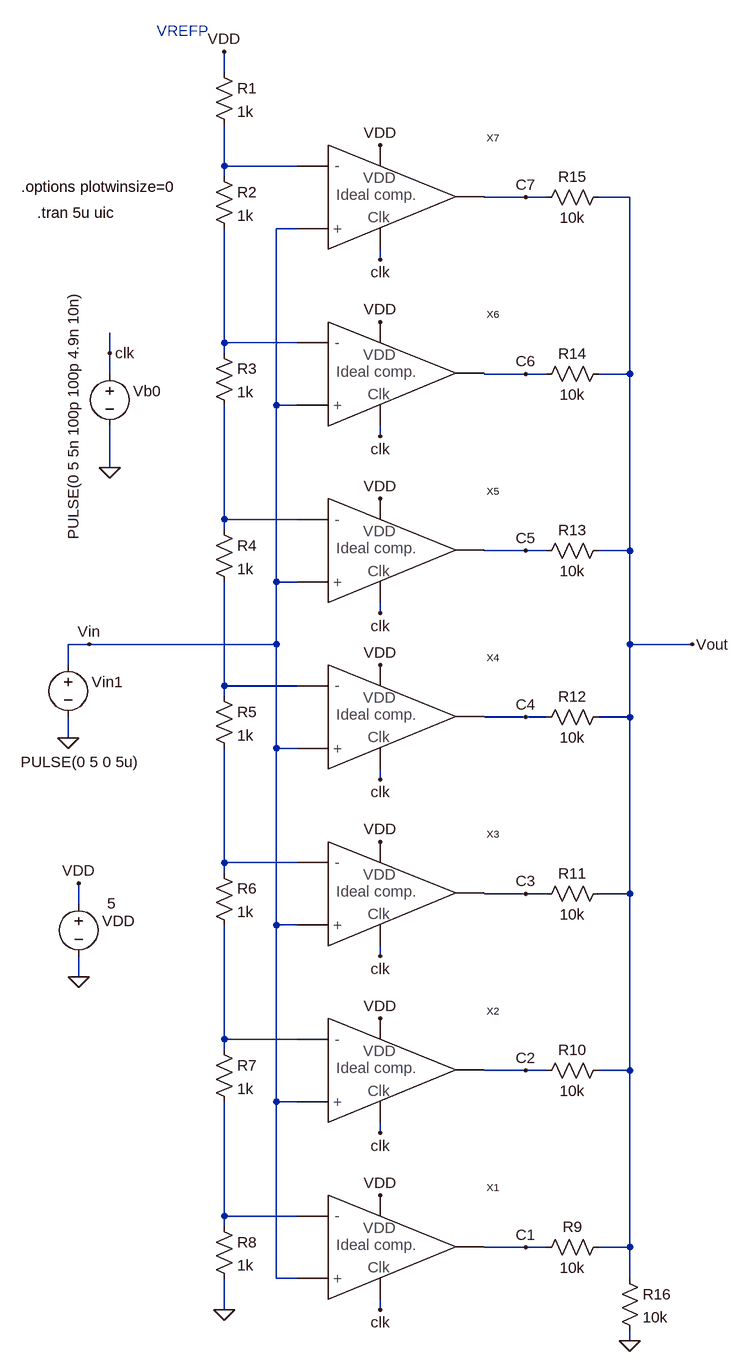
[diagram p0: schematic Fig29_23.asc]
Fig29_23.asc, the LTspice schematic file:
Version 4
SHEET 1 1608 932
WIRE 816 -1088 816 -1120
WIRE 816 -944 816 -1008
WIRE 928 -944 816 -944
WIRE 816 -928 816 -944
WIRE 1280 -896 1216 -896
WIRE 1312 -896 1280 -896
WIRE 1440 -896 1392 -896
WIRE 928 -848 896 -848
WIRE 1056 -800 1056 -816
WIRE 816 -672 816 -848
WIRE 928 -672 816 -672
WIRE 640 -656 640 -688
WIRE 816 -656 816 -672
WIRE 640 -624 640 -656
WIRE 1280 -624 1216 -624
WIRE 1312 -624 1280 -624
WIRE 1440 -624 1440 -896
WIRE 1440 -624 1392 -624
WIRE 896 -576 896 -848
WIRE 928 -576 896 -576
WIRE 1056 -528 1056 -544
WIRE 640 -480 640 -544
WIRE 816 -400 816 -576
WIRE 928 -400 816 -400
WIRE 816 -384 816 -400
WIRE 1280 -352 1216 -352
WIRE 1312 -352 1280 -352
WIRE 1440 -352 1440 -624
WIRE 1440 -352 1392 -352
WIRE 896 -304 896 -576
WIRE 928 -304 896 -304
WIRE 1056 -256 1056 -272
WIRE 608 -208 576 -208
WIRE 896 -208 896 -304
WIRE 896 -208 608 -208
WIRE 1440 -208 1440 -352
WIRE 1536 -208 1440 -208
WIRE 576 -176 576 -208
WIRE 816 -144 816 -304
WIRE 928 -144 816 -144
WIRE 816 -128 816 -144
WIRE 1280 -96 1216 -96
WIRE 1312 -96 1280 -96
WIRE 1440 -96 1440 -208
WIRE 1440 -96 1392 -96
WIRE 576 -64 576 -96
WIRE 896 -48 896 -208
WIRE 928 -48 896 -48
WIRE 1056 0 1056 -16
WIRE 816 128 816 -48
WIRE 928 128 816 128
WIRE 816 144 816 128
WIRE 1280 176 1216 176
WIRE 1312 176 1280 176
WIRE 1440 176 1440 -96
WIRE 1440 176 1392 176
WIRE 592 192 592 160
WIRE 896 224 896 -48
WIRE 928 224 896 224
WIRE 1056 272 1056 256
WIRE 592 304 592 272
WIRE 816 400 816 224
WIRE 928 400 816 400
WIRE 816 416 816 400
WIRE 1280 448 1216 448
WIRE 1312 448 1280 448
WIRE 1440 448 1440 176
WIRE 1440 448 1392 448
WIRE 896 496 896 224
WIRE 928 496 896 496
WIRE 1056 544 1056 528
WIRE 816 672 816 496
WIRE 928 672 816 672
WIRE 816 688 816 672
WIRE 1280 720 1216 720
WIRE 1312 720 1280 720
WIRE 1440 720 1440 448
WIRE 1440 720 1392 720
WIRE 896 768 896 496
WIRE 928 768 896 768
WIRE 1440 768 1440 720
WIRE 816 816 816 768
WIRE 1056 816 1056 800
WIRE 1440 864 1440 848
FLAG 640 -480 0
FLAG 592 304 0
FLAG 592 160 VDD
FLAG 640 -656 clk
FLAG 816 816 0
FLAG 816 -1120 VDD
FLAG 1056 816 clk
FLAG 1056 640 VDD
FLAG 1280 720 C1
FLAG 1056 544 clk
FLAG 1056 368 VDD
FLAG 1280 448 C2
FLAG 1056 272 clk
FLAG 1056 96 VDD
FLAG 1280 176 C3
FLAG 1056 0 clk
FLAG 1056 -176 VDD
FLAG 1280 -96 C4
FLAG 1056 -256 clk
FLAG 1056 -432 VDD
FLAG 1280 -352 C5
FLAG 1056 -528 clk
FLAG 1056 -704 VDD
FLAG 1280 -624 C6
FLAG 1056 -800 clk
FLAG 1056 -976 VDD
FLAG 1280 -896 C7
FLAG 576 -64 0
FLAG 608 -208 Vin
FLAG 1536 -208 Vout
FLAG 1440 864 0
SYMBOL voltage 640 -640 R0
WINDOW 0 36 42 Left 0
WINDOW 3 -56 271 VLeft 0
WINDOW 123 0 0 Left 0
WINDOW 39 0 0 Left 0
SYMATTR InstName Vb0
SYMATTR Value PULSE(0 5 5n 100p 100p 4.9n 10n)
SYMBOL voltage 592 176 R0
WINDOW 0 36 42 Left 0
WINDOW 3 44 15 Left 0
WINDOW 123 0 0 Left 0
WINDOW 39 0 0 Left 0
SYMATTR InstName VDD
SYMATTR Value 5
SYMBOL res 800 -1104 R0
SYMATTR InstName R1
SYMATTR Value 1k
SYMBOL res 800 -944 R0
SYMATTR InstName R2
SYMATTR Value 1k
SYMBOL res 800 -672 R0
SYMATTR InstName R3
SYMATTR Value 1k
SYMBOL res 800 -400 R0
SYMATTR InstName R4
SYMATTR Value 1k
SYMBOL res 800 -144 R0
SYMATTR InstName R5
SYMATTR Value 1k
SYMBOL res 800 128 R0
SYMATTR InstName R6
SYMATTR Value 1k
SYMBOL res 800 400 R0
SYMATTR InstName R7
SYMATTR Value 1k
SYMBOL res 800 672 R0
SYMATTR InstName R8
SYMATTR Value 1k
SYMBOL Ideal_clocked_comparator 976 720 R0
SYMATTR InstName X1
SYMBOL Ideal_clocked_comparator 976 448 R0
SYMATTR InstName X2
SYMBOL Ideal_clocked_comparator 976 176 R0
SYMATTR InstName X3
SYMBOL Ideal_clocked_comparator 976 -96 R0
SYMATTR InstName X4
SYMBOL Ideal_clocked_comparator 976 -352 R0
SYMATTR InstName X5
SYMBOL Ideal_clocked_comparator 976 -624 R0
SYMATTR InstName X6
SYMBOL Ideal_clocked_comparator 976 -896 R0
SYMATTR InstName X7
SYMBOL voltage 576 -192 R0
WINDOW 0 36 42 Left 0
WINDOW 3 -73 165 Left 0
WINDOW 123 0 0 Left 0
WINDOW 39 0 0 Left 0
SYMATTR InstName Vin1
SYMATTR Value PULSE(0 5 0 5u)
SYMBOL res 1296 736 R270
WINDOW 0 32 56 VTop 0
WINDOW 3 0 56 VBottom 0
SYMATTR InstName R9
SYMATTR Value 10k
SYMBOL res 1296 464 R270
WINDOW 0 32 56 VTop 0
WINDOW 3 0 56 VBottom 0
SYMATTR InstName R10
SYMATTR Value 10k
SYMBOL res 1296 192 R270
WINDOW 0 32 56 VTop 0
WINDOW 3 0 56 VBottom 0
SYMATTR InstName R11
SYMATTR Value 10k
SYMBOL res 1296 -80 R270
WINDOW 0 32 56 VTop 0
WINDOW 3 0 56 VBottom 0
SYMATTR InstName R12
SYMATTR Value 10k
SYMBOL res 1296 -336 R270
WINDOW 0 32 56 VTop 0
WINDOW 3 0 56 VBottom 0
SYMATTR InstName R13
SYMATTR Value 10k
SYMBOL res 1296 -608 R270
WINDOW 0 32 56 VTop 0
WINDOW 3 0 56 VBottom 0
SYMATTR InstName R14
SYMATTR Value 10k
SYMBOL res 1296 -880 R270
WINDOW 0 32 56 VTop 0
WINDOW 3 0 56 VBottom 0
SYMATTR InstName R15
SYMATTR Value 10k
SYMBOL res 1424 752 R0
SYMATTR InstName R16
SYMATTR Value 10k
TEXT 528 -872 Left 0 !.tran 5u uic
TEXT 504 -912 Left 0 !.options plotwinsize=0
TEXT 712 -1152 Left 0 ;VREFP

The netlist it stands for:
* Fig29_23.asc
Vb0 clk 0 PULSE(0 5 5n 100p 100p 4.9n 10n)
VDD VDD 0 5
R1 VDD N001 1k
R2 N001 N002 1k
R3 N002 N003 1k
R4 N003 N004 1k
R5 N004 N005 1k
R6 N005 N006 1k
R7 N006 N007 1k
R8 N007 0 1k
XX1 N007 Vin C1 VDD clk Ideal_clocked_comparator  ; pins Vinm Vinp Vout VDD Clock
XX2 N006 Vin C2 VDD clk Ideal_clocked_comparator  ; pins Vinm Vinp Vout VDD Clock
XX3 N005 Vin C3 VDD clk Ideal_clocked_comparator  ; pins Vinm Vinp Vout VDD Clock
XX4 N004 Vin C4 VDD clk Ideal_clocked_comparator  ; pins Vinm Vinp Vout VDD Clock
XX5 N003 Vin C5 VDD clk Ideal_clocked_comparator  ; pins Vinm Vinp Vout VDD Clock
XX6 N002 Vin C6 VDD clk Ideal_clocked_comparator  ; pins Vinm Vinp Vout VDD Clock
XX7 N001 Vin C7 VDD clk Ideal_clocked_comparator  ; pins Vinm Vinp Vout VDD Clock
Vin1 Vin 0 PULSE(0 5 0 5u)
R9 C1 Vout 10k
R10 C2 Vout 10k
R11 C3 Vout 10k
R12 C4 Vout 10k
R13 C5 Vout 10k
R14 C6 Vout 10k
R15 C7 Vout 10k
R16 Vout 0 10k
.tran 5u uic
.options plotwinsize=0
* VREFP
.backanno
.end